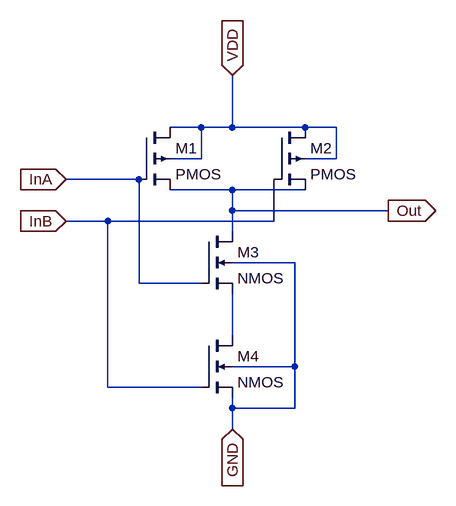
[diagram p0: schematic NAND.asc]
NAND.asc, the LTspice schematic file:
Version 4
SHEET 1 880 680
WIRE 208 32 160 32
WIRE 256 32 256 -48
WIRE 256 32 208 32
WIRE 368 32 256 32
WIRE 416 32 368 32
WIRE 208 80 208 32
WIRE 208 80 160 80
WIRE 416 80 416 32
WIRE 416 80 368 80
WIRE 112 112 0 112
WIRE 256 128 160 128
WIRE 368 128 256 128
WIRE 256 160 256 128
WIRE 496 160 256 160
WIRE 64 176 0 176
WIRE 320 176 320 112
WIRE 320 176 64 176
WIRE 256 192 256 160
WIRE 352 240 256 240
WIRE 112 272 112 112
WIRE 208 272 112 272
WIRE 256 352 256 288
WIRE 352 400 352 240
WIRE 352 400 256 400
WIRE 64 432 64 176
WIRE 208 432 64 432
WIRE 256 464 256 448
WIRE 352 464 352 400
WIRE 352 464 256 464
WIRE 256 496 256 464
FLAG 256 -48 VDD
IOPIN 256 -48 In
FLAG 0 176 InB
IOPIN 0 176 In
FLAG 0 112 InA
IOPIN 0 112 In
FLAG 496 160 Out
IOPIN 496 160 Out
FLAG 256 496 GND
IOPIN 256 496 In
SYMBOL pmos4 112 32 R0
SYMATTR InstName M1
SYMBOL pmos4 320 32 R0
SYMATTR InstName M2
SYMBOL nmos4 208 192 R0
SYMATTR InstName M3
SYMBOL nmos4 208 352 R0
SYMATTR InstName M4

The netlist it stands for:
* NAND.asc
M1 VDD InA Out VDD PMOS
M2 VDD InB Out VDD PMOS
M3 Out InA N001 GND NMOS
M4 N001 InB GND GND NMOS
.model NMOS NMOS
.model PMOS PMOS
.lib standard.mos
.backanno
.end